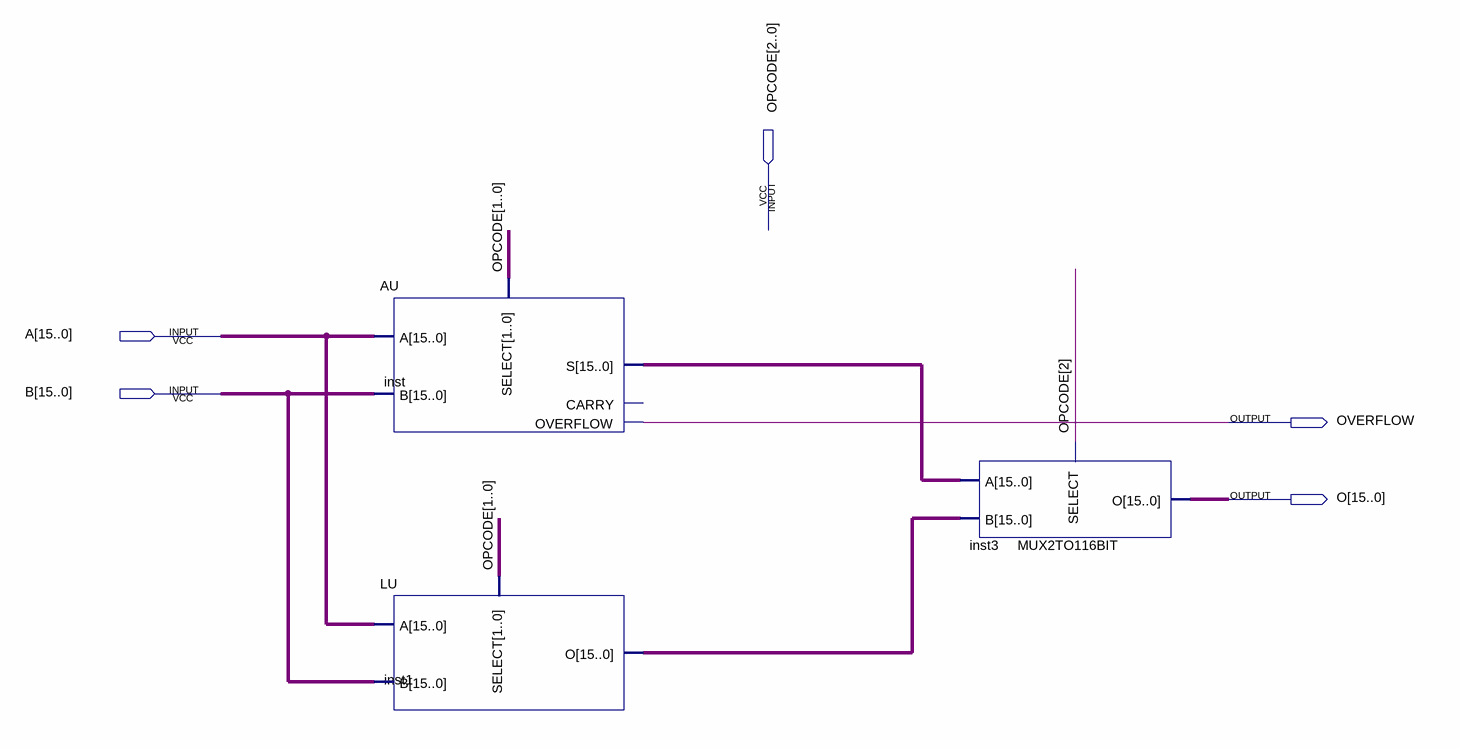
[diagram p0: schematic sheet]
// Quartus schematic ALU.bdf as structural Verilog: 3 symbols, 5 pins
module ALU (
  input  [2:0] OPCODE,
  input  [15:0] A,
  input  [15:0] B,
  output OVERFLOW,
  output [15:0] O
);

  wire [15:0] inst1_o, inst_s;

  AU inst (.A(A), .B(B), .SELECT(OPCODE[1:0]), .S(inst_s), .OVERFLOW(OVERFLOW));  // open: CARRY
  LU inst1 (.A(A), .B(B), .SELECT(OPCODE[1:0]), .O(inst1_o));
  MUX2TO116BIT inst3 (.A(inst_s), .B(inst1_o), .SELECT(OPCODE[2]), .O(O));
endmodule
